# Altium project NXP_FRDM_IMX93.PrjPcb (part 7 of 13)

## Sheet E-15 ENET2.SchDoc: FRDM-IMX93
size 513 x 386 mm; DrawnBy: FORLINX; Organization: ORGANIZATION; Address1: ADDRESS 1; Address2: ADDRESS 2; Address3: ADDRESS 3; Address4: ADDRESS 4; Revision: -; ENG_APP_DATE: --/--/--; DSN_APP_DATE: --/--/--; CHK_APP_DATE: --/--/--; Classification: Public, Company Internal/Proprietary, Company Confidential,  Company Secret; Page Create Date: March  8, 1995; OrgName: NXP Semiconductor; FIUO: A; OrgAddr1: NO. 192 Liangjing Rd. Pudong New Area, ShangHai; Page Number: 15; PageTitle: ENET2; Page Size: C; Page Count: 23; Designer: FORLINX; RevCode: B1; Approver: NXP SE; Doc: SCH-94611 PDF: SPF-94611; DsnPath: T:\FILES\Designs\Single Board Computers\i.MX93-FRDM\Design Files\SCH-94611_B1.DSN; SchematicName: FRDM-i.MX 93 Development Board; PageName: E-15 ENET2; PageSize: C; TopSchematic: True
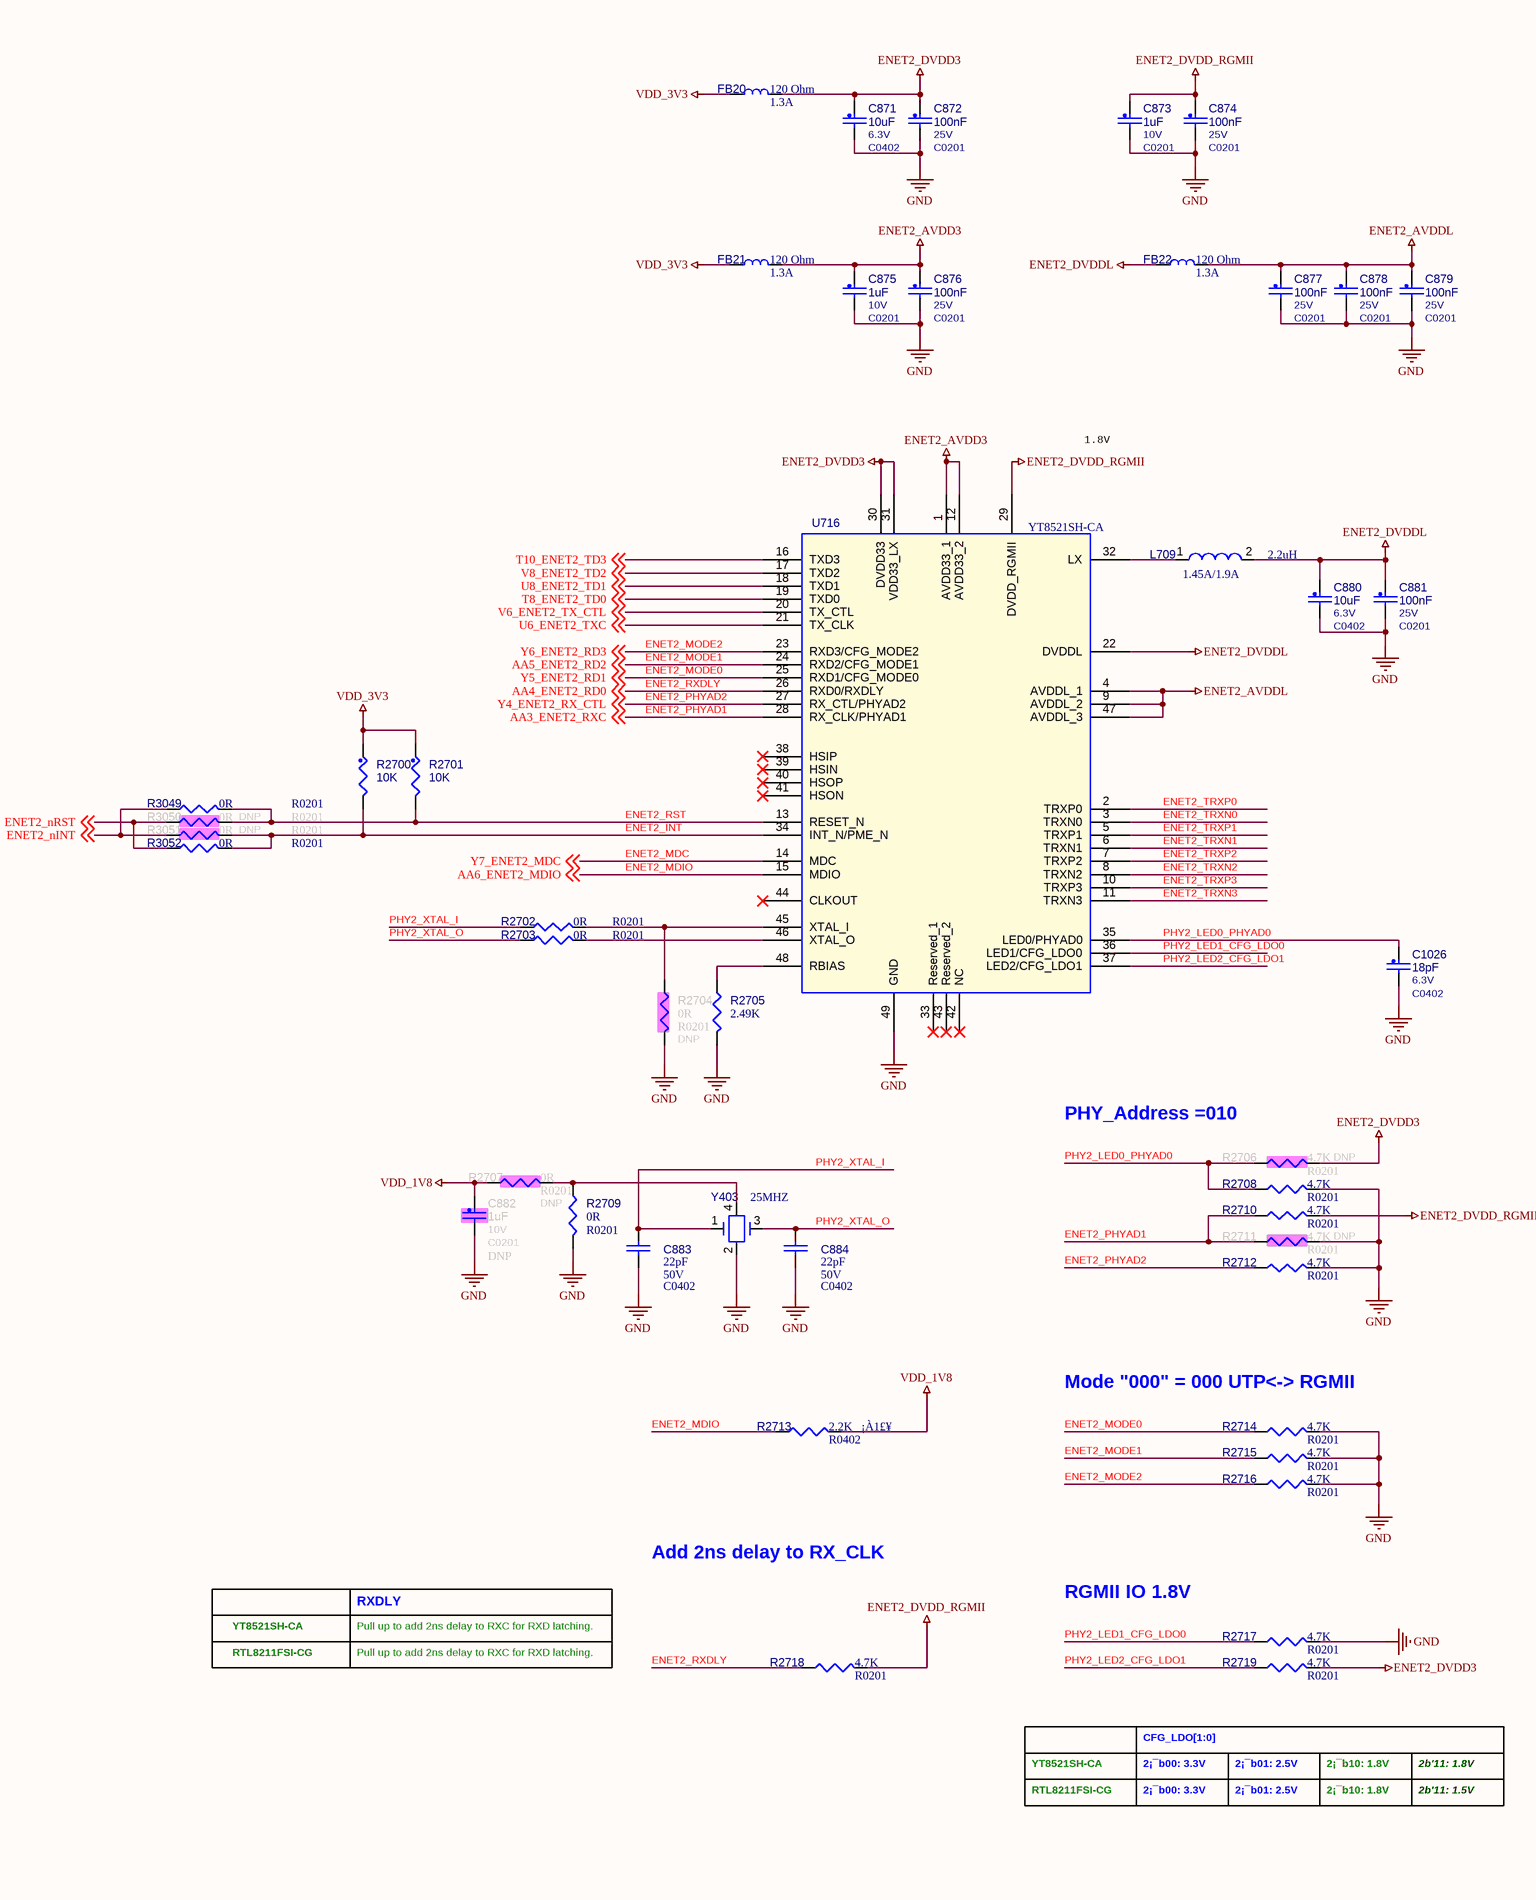
[diagram p27: E-15 ENET2.SchDoc, left]
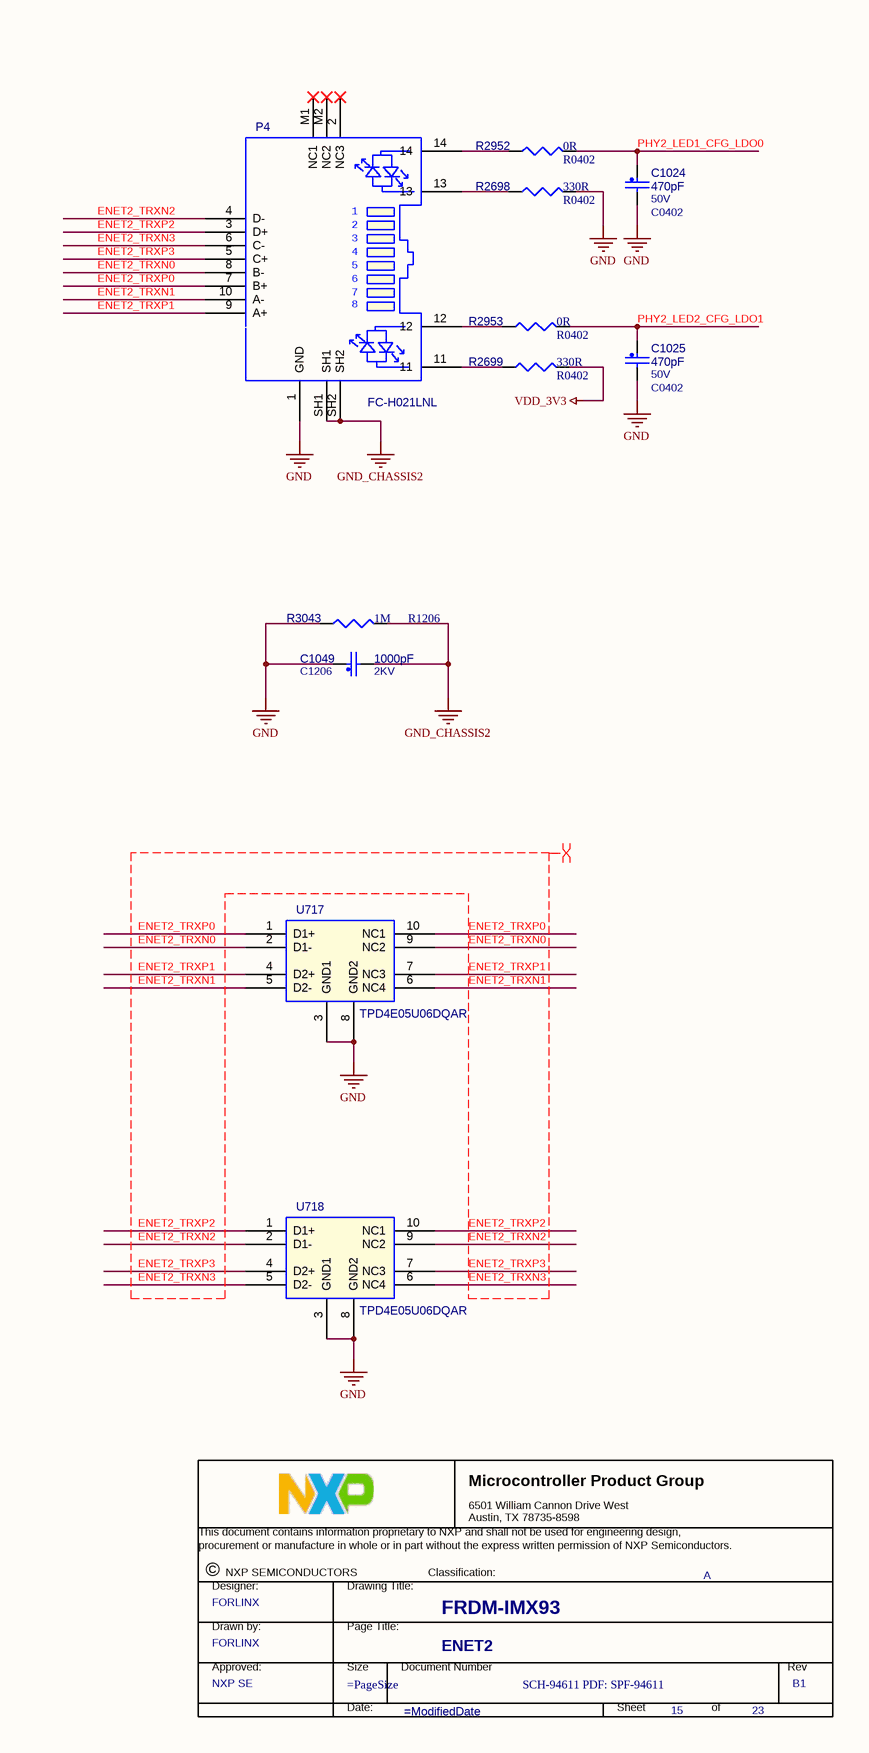
[diagram p28: E-15 ENET2.SchDoc, right]

### Parts
(Parts that share a designator on the sheet are numbered #1, #2 ... from top to bottom, then left to right.)
*#15  Title: FRDM-IMX93  RevCode: B1  PageTitle: ENET2  Page Number: 15  Page Count: 23  DrawnBy: FORLINX  Doc: SCH-94611 PDF: SPF-94611  Approver: NXP SE  FIUO: A  (graphical)
C871  10uF  VOLTAGE: 6.3V  [C0402]
C872  100nF  VOLTAGE: 25V  [C0201]
C873  1uF  VOLTAGE: 10V  [C0201]
C874  100nF  VOLTAGE: 25V  [C0201]
C875  1uF  VOLTAGE: 10V  [C0201]
C876  100nF  VOLTAGE: 25V  [C0201]
C877  100nF  VOLTAGE: 25V  [C0201]
C878  100nF  VOLTAGE: 25V  [C0201]
C879  100nF  VOLTAGE: 25V  [C0201]
C880  10uF  VOLTAGE: 6.3V  [C0402]
C881  100nF  VOLTAGE: 25V  [C0201]
C882  1uF  ASSY_OPT: DNP  VOLTAGE: 10V  [C0201]
C883  22pF  Voltage: 50V  [C0402]
C884  22pF  Voltage: 50V  [C0402]
C1024  470pF  VOLTAGE: 50V  [C0402]
C1025  470pF  VOLTAGE: 50V  [C0402]
C1026  18pF  VOLTAGE: 6.3V  [C0402]
C1049  1000pF  VOLTAGE: 2KV  [C1206]
FB20  120 Ohm  electric current: 1.3A  [FB0402]
FB21  120 Ohm  electric current: 1.3A  [FB0402]
FB22  120 Ohm  electric current: 1.3A  [FB0402]
L709  2.2uH  electric current: 1.45A/1.9A  [IND_2016A]
P4  FC-H021LNL  [RJ45-Gigabit]
R2698  330R  [R0402]
R2699  330R  [R0402]
R2700  10K  [R0201]
R2701  10K  [R0201]
R2702  0R  [R0201]
R2703  0R  [R0201]
R2704  0R  ASSY_OPT: DNP  [R0201]
R2705  2.49K  [R0402]
R2706  4.7K  ASSY_OPT: DNP  [R0201]
R2707  0R  ASSY_OPT: DNP  [R0201]
R2708  4.7K  [R0201]
R2709  0R  [R0201]
R2710  4.7K  [R0201]
R2711  4.7K  ASSY_OPT: DNP  [R0201]
R2712  4.7K  [R0201]
R2713  2.2K  precision: ¡À1£¥  [R0402]
R2714  4.7K  [R0201]
R2715  4.7K  [R0201]
R2716  4.7K  [R0201]
R2717  4.7K  [R0201]
R2718  4.7K  [R0201]
R2719  4.7K  [R0201]
R2952  0R  [R0402]
R2953  0R  [R0402]
R3043  1M  [R1206]
R3049  0R  [R0201]
R3050  0R  ASSY_OPT: DNP  [R0201]
R3051  0R  ASSY_OPT: DNP  [R0201]
R3052  0R  [R0201]
U716  YT8521SH-CA  [QFN48P_0_4BSC_6x6_H]
U717  TPD4E05U06DQAR  [USON-10]
U718  TPD4E05U06DQAR  [USON-10]
Y403  25MHZ  [xtlosc4_3p2x2p5mm_sm]

### Nets
ENET2_AVDD3: C875.1 C876.1 FB21.2 U716.1(AVDD33_1) U716.12(AVDD33_2)
ENET2_AVDDL: C877.1 C878.1 C879.1 FB22.2 U716.4(AVDDL_1) U716.9(AVDDL_2) U716.47(AVDDL_3)
ENET2_DVDD3: C871.1 C872.1 FB20.2 R2706.2 R2719.2 U716.30(DVDD33) U716.31(VDD33_LX)
ENET2_DVDD_RGMII: C873.1 C874.1 R2710.2 R2718.2 U716.29(DVDD_RGMII)
ENET2_DVDDL: C880.1 C881.1 FB22.1 L709.2 U716.22(DVDDL)
GND: C871.2 C872.2 C873.2 C874.2 C875.2 C876.2 C877.2 C878.2 C879.2 C880.2 C881.2 C882.2 C883.2 C884.2 C1024.2 C1025.2 C1026.2 C1049.1 P4.1(GND) R2698.2 R2704.2 R2705.2 R2708.2 R2709.2 R2711.2 R2712.2 R2714.2 R2715.2 R2716.2 R2717.2 R3043.1 U716.49(GND) U717.3(GND1) U717.8(GND2) U718.3(GND1) U718.8(GND2) Y403.2
GND_CHASSIS2: C1049.2 P4.SH1 P4.SH2 R3043.2
VDD_1V8: C882.1 R2707.1 R2713.2  [project net LPD4/x_VDD1]
VDD_3V3: FB20.1 FB21.1 R2699.2 R2700.1 R2701.1
AA4_ENET2_RD0: R2718.1 U716.26(RXD0/RXDLY) ; off-sheet AA4_ENET2_RD0  [also labelled ENET2_RXDLY]  [project net ENET2_RD0]
ENET2_INT: R2700.2 R3051.2 R3052.2 U716.34(INT_N/PME_N)
ENET2_MDC: U716.14(MDC) ; off-sheet Y7_ENET2_MDC  [also labelled Y7_ENET2_MDC]
ENET2_MDIO: R2713.1 U716.15(MDIO) ; off-sheet AA6_ENET2_MDIO  [also labelled AA6_ENET2_MDIO]
ENET2_MODE0: R2714.1 U716.25(RXD1/CFG_MODE0) ; off-sheet Y5_ENET2_RD1  [also labelled Y5_ENET2_RD1]
ENET2_MODE1: R2715.1 U716.24(RXD2/CFG_MODE1) ; off-sheet AA5_ENET2_RD2  [also labelled AA5_ENET2_RD2]
ENET2_MODE2: R2716.1 U716.23(RXD3/CFG_MODE2) ; off-sheet Y6_ENET2_RD3  [also labelled Y6_ENET2_RD3]
ENET2_nINT: R3049.1 R3051.1 ; off-sheet ENET2_nINT
ENET2_nRST: R3050.1 R3052.1 ; off-sheet ENET2_nRST
ENET2_PHYAD1: R2710.1 R2711.1 U716.28(RX_CLK/PHYAD1) ; off-sheet AA3_ENET2_RXC  [also labelled AA3_ENET2_RXC]
ENET2_PHYAD2: R2712.1 U716.27(RX_CTL/PHYAD2) ; off-sheet Y4_ENET2_RX_CTL  [also labelled Y4_ENET2_RX_CTL]
ENET2_RST: R2701.2 R3049.2 R3050.2 U716.13(RESET_N)
ENET2_TRXN0: P4.8(B-) U716.3(TRXN0) U717.2(D1-) U717.9(NC2)
ENET2_TRXN1: P4.10(A-) U716.6(TRXN1) U717.5(D2-) U717.6(NC4)
ENET2_TRXN2: P4.4(D-) U716.8(TRXN2) U718.2(D1-) U718.9(NC2)
ENET2_TRXN3: P4.6(C-) U716.11(TRXN3) U718.5(D2-) U718.6(NC4)
ENET2_TRXP0: P4.7(B+) U716.2(TRXP0) U717.1(D1+) U717.10(NC1)
ENET2_TRXP1: P4.9(A+) U716.5(TRXP1) U717.4(D2+) U717.7(NC3)
ENET2_TRXP2: P4.3(D+) U716.7(TRXP2) U718.1(D1+) U718.10(NC1)
ENET2_TRXP3: P4.5(C+) U716.10(TRXP3) U718.4(D2+) U718.7(NC3)
PHY2_LED0_PHYAD0: C1026.1 R2706.1 R2708.1 U716.35(LED0/PHYAD0)
PHY2_LED1_CFG_LDO0: C1024.1 R2717.1 R2952.2 U716.36(LED1/CFG_LDO0)
PHY2_LED2_CFG_LDO1: C1025.1 R2719.1 R2953.2 U716.37(LED2/CFG_LDO1)
PHY2_XTAL_I: C883.1 R2702.1 Y403.1
PHY2_XTAL_O: C884.1 R2703.1 Y403.3
T8_ENET2_TD0: U716.19(TXD0) ; off-sheet T8_ENET2_TD0  [project net ENET2_TD0]
T10_ENET2_TD3: U716.16(TXD3) ; off-sheet T10_ENET2_TD3  [project net ENET2_TD3]
U6_ENET2_TXC: U716.21(TX_CLK) ; off-sheet U6_ENET2_TXC  [project net ENET2_TXC]
U8_ENET2_TD1: U716.18(TXD1) ; off-sheet U8_ENET2_TD1  [project net ENET2_TD1]
V6_ENET2_TX_CTL: U716.20(TX_CTL) ; off-sheet V6_ENET2_TX_CTL  [project net ENET2_TX_CTL]
V8_ENET2_TD2: U716.17(TXD2) ; off-sheet V8_ENET2_TD2  [project net ENET2_TD2]
NetL709_1: L709.1 U716.32(LX)
NetP4_11: P4.11 R2699.1
NetP4_12: P4.12 R2953.1
NetP4_13: P4.13 R2698.1
NetP4_14: P4.14 R2952.1
NetR2702_2: R2702.2 R2704.1 U716.45(XTAL_I)
NetR2703_2: R2703.2 U716.46(XTAL_O)
NetR2705_1: R2705.1 U716.48(RBIAS)
NetR2707_2: R2707.2 R2709.1 Y403.4

Not connected (* = marked no-connect by the designer): P4 2(NC3)* M1(NC1)* M2(NC2)*; U716 33(Reserved_1)* 38(HSIP)* 39(HSIN)* 40(HSOP)* 41(HSON)* 42(NC)* 43(Reserved_2)* 44(CLKOUT)*

### Layout directives
differential pair: ENET2_TRXN0, ENET2_TRXN1, ENET2_TRXN2, ENET2_TRXN3, ENET2_TRXP0, ENET2_TRXP1, ENET2_TRXP2, ENET2_TRXP3

### Notes on the sheet
- 1.8V
- PHY_Address =010
- (near R2714) Mode "000" = 000 UTP<-> RGMII
- Add 2ns delay to RX_CLK
- YT8521SH-CA
- Pull up to add 2ns delay to RXC for RXD latching.
- RXDLY
- RGMII IO 1.8V
- RTL8211FSI-CG
- 2¡¯b00: 3.3V
- CFG_LDO[1:0]
- 2¡¯b01: 2.5V
- 2¡¯b10: 1.8V
- 2b'11: 1.8V
- 2b'11: 1.5V
- DWG. NO.
- REV.
- SHT.
- REVISION
- DESCRIPTION
- DATE
- APPROVED
- ENG:
- APPROVALS
- quilter.ai <http://quilter.ai>
- DSN:
- CHK:
- REFERENCE DOCUMENTS
- TITLE
- PROJECT
- BOM:
- FAB DWG:
- PCB DWG:
- ASSY DWG:
- SIZE
- FILE NAME
- C
- DWG NO.
- SHEET
- OF
- REV
- (in symbol TitleBlock_MCPG) Microcontroller Product Group; 6501 William Cannon Drive West / Austin, TX 78735-8598; This document contains information proprietary to NXP and shall not be used for engineering design,; procurement or manufacture in whole or in part without the express written permission of NXP Semiconductors.; ©; NXP SEMICONDUCTORS; Classification:; Designer:; Drawing Title:; Drawn by:; Page Title:; Approved:; Size; Document Number; Rev; Date:; Sheet; of

### Library data of the parts
*#15 = TitleBlock_MCPG: Classification: Public, Company Internal/Proprietary, Company Confidential,  Company Secret; OrgName: NXP Semiconductor; OrgAddr1: NO. 192 Liangjing Rd. Pudong New Area, ShangHai; Page Size: =PageSize; Page Create Date: March  8, 1995; Designer: FORLINX; Page Modify Date: =ModifiedDate
C871 = CAP_NP: 0402,10uF,6.3V,+/-20%,X5R; Part Reference: C871; CLASS: DISCRETE; Tolerance: 20%; MFG_NAME01: FENGHUA; MFG_PN01: 0402X106M6R3NT; CAD_APPROVED: Yes; FPLIST: CC0402_25,CC0402_HD,0402_CC; Value: 10uF; ROHS: Yes; HEIGHT: 0.65 MM; PCB Footprint: C0402
C872 = CAP_NP: 0201,100nF,25V,+/-10%,X5R; Part Reference: C872; CLASS: DISCRETE; FPLIST: CC0402_25,CC0402_HD,0402_CC; CAD_APPROVED: Yes; MFG_PN01: 0201X104K250NT; MFG_NAME01: FENGHUA; Tolerance: 20%; Value: 100nF; HEIGHT: 0.65 MM; ROHS: Yes; PCB Footprint: C0201
C873 = CAP_NP: 0201,1uF,10V,+/-20%,X5R; Part Reference: C873; CLASS: DISCRETE; FPLIST: CC0201,CC0201_HD,0201_CC,0201_CC_012SM_NSP; CAD_APPROVED: Yes; MFG_PN01: CL03A105MP3NSNC; MFG_NAME01: SAMSUNG; Tolerance: 20%; Value: 1uF; Package Type: 7¡± reel; Package Size: 0201; HEIGHT: 0.35MM; ROHS: Yes; PCB Footprint: C0201
C874 = CAP_NP: 0201,100nF,25V,+/-10%,X5R; Part Reference: C874; CLASS: DISCRETE; Tolerance: 20%; MFG_NAME01: FENGHUA; MFG_PN01: 0201X104K250NT; CAD_APPROVED: Yes; FPLIST: CC0402_25,CC0402_HD,0402_CC; Value: 100nF; ROHS: Yes; HEIGHT: 0.65 MM; PCB Footprint: C0201
C875 = CAP_NP: 0201,1uF,10V,+/-20%,X5R; Part Reference: C875; CLASS: DISCRETE; Tolerance: 20%; MFG_NAME01: SAMSUNG; MFG_PN01: CL03A105MP3NSNC; CAD_APPROVED: Yes; FPLIST: CC0201,CC0201_HD,0201_CC,0201_CC_012SM_NSP; Value: 1uF; ROHS: Yes; HEIGHT: 0.35MM; Package Size: 0201; Package Type: 7¡± reel; PCB Footprint: C0201
C876 = CAP_NP: 0201,100nF,25V,+/-10%,X5R; Part Reference: C876; CLASS: DISCRETE; FPLIST: CC0402_25,CC0402_HD,0402_CC; CAD_APPROVED: Yes; MFG_PN01: 0201X104K250NT; MFG_NAME01: FENGHUA; Tolerance: 20%; Value: 100nF; HEIGHT: 0.65 MM; ROHS: Yes; PCB Footprint: C0201
C877 = CAP_NP: 0201,100nF,25V,+/-10%,X5R; Part Reference: C877; CLASS: DISCRETE; FPLIST: CC0402_25,CC0402_HD,0402_CC; CAD_APPROVED: Yes; MFG_PN01: 0201X104K250NT; MFG_NAME01: FENGHUA; Tolerance: 20%; Value: 100nF; HEIGHT: 0.65 MM; ROHS: Yes; PCB Footprint: C0201
C878 = CAP_NP: 0201,100nF,25V,+/-10%,X5R; Part Reference: C878; CLASS: DISCRETE; FPLIST: CC0402_25,CC0402_HD,0402_CC; CAD_APPROVED: Yes; MFG_PN01: 0201X104K250NT; MFG_NAME01: FENGHUA; Tolerance: 20%; Value: 100nF; HEIGHT: 0.65 MM; ROHS: Yes; PCB Footprint: C0201
C879 = CAP_NP: 0201,100nF,25V,+/-10%,X5R; Part Reference: C879; CLASS: DISCRETE; Tolerance: 20%; MFG_NAME01: FENGHUA; MFG_PN01: 0201X104K250NT; CAD_APPROVED: Yes; FPLIST: CC0402_25,CC0402_HD,0402_CC; Value: 100nF; ROHS: Yes; HEIGHT: 0.65 MM; PCB Footprint: C0201
C880 = CAP_NP: 0402,10uF,6.3V,+/-20%,X5R; Part Reference: C880; CLASS: DISCRETE; Tolerance: 20%; MFG_NAME01: FENGHUA; MFG_PN01: 0402X106M6R3NT; CAD_APPROVED: Yes; FPLIST: CC0402_25,CC0402_HD,0402_CC; Value: 10uF; ROHS: Yes; HEIGHT: 0.65 MM; PCB Footprint: C0402
C881 = CAP_NP: 0201,100nF,25V,+/-10%,X5R; Part Reference: C881; CLASS: DISCRETE; Tolerance: 20%; MFG_NAME01: FENGHUA; MFG_PN01: 0201X104K250NT; CAD_APPROVED: Yes; FPLIST: CC0402_25,CC0402_HD,0402_CC; Value: 100nF; ROHS: Yes; HEIGHT: 0.65 MM; PCB Footprint: C0201
C882 = CAP_NP: 0201,1uF,10V,+/-20%,X5R; Part Reference: C882; CLASS: DISCRETE; Tolerance: 20%; MFG_NAME01: SAMSUNG; MFG_PN01: CL03A105MP3NSNC; CAD_APPROVED: Yes; FPLIST: CC0201,CC0201_HD,0201_CC,0201_CC_012SM_NSP; Value: 1uF; ROHS: Yes; HEIGHT: 0.35MM; Package Size: 0201; Package Type: 7¡± reel; PCB Footprint: C0201
C883 = C0402,22pF: 0402,22pF,50V,+/-5%,NPO; Part Reference: C883; serial number: 1110202003; MFG_NAME01: FENGHUA; MFG_PN01: 0402CG220J500NT; PCB Footprint: C0402; Value: 22pF
C884 = C0402,22pF: 0402,22pF,50V,+/-5%,NPO; Part Reference: C884; serial number: 1110202003; MFG_NAME01: FENGHUA; MFG_PN01: 0402CG220J500NT; PCB Footprint: C0402; Value: 22pF
C1024 = CAP_NP: 0402,470pF,50V,+/-5%,NPO; Part Reference: C1024; CLASS: DISCRETE; Tolerance: 20%; MFG_NAME01: FENGHUA; MFG_PN01: 0402CG471J500NT; CAD_APPROVED: Yes; FPLIST: CC0402_25,CC0402_HD,0402_CC; Value: 470pF; ROHS: Yes; HEIGHT: 0.65 MM; PCB Footprint: C0402
C1025 = CAP_NP: 0402,470pF,50V,+/-5%,NPO; Part Reference: C1025; CLASS: DISCRETE; FPLIST: CC0402_25,CC0402_HD,0402_CC; CAD_APPROVED: Yes; MFG_PN01: 0402CG471J500NT; MFG_NAME01: FENGHUA; Tolerance: 20%; Value: 470pF; HEIGHT: 0.65 MM; ROHS: Yes; PCB Footprint: C0402
C1026 = CAP_NP: 0402,18pF,50V,+/-5%,NPO; Part Reference: C1026; CLASS: DISCRETE; Tolerance: 20%; MFG_NAME01: FENGHUA; MFG_PN01: 0402B103K500NT; CAD_APPROVED: Yes; FPLIST: CC0402_25,CC0402_HD,0402_CC; Value: 18pF; ROHS: Yes; HEIGHT: 0.65 MM; PCB Footprint: C0402
C1049 = CAP_NP: 1206,1nF,2KV,+/-10%; Part Reference: C1049; CLASS: DISCRETE; Tolerance: 20%; MFG_NAME01: FENGHUA; MFG_PN01: 1206B102K202NT; CAD_APPROVED: Yes; FPLIST: CC0402_25,CC0402_HD,0402_CC; Value: 1000pF; ROHS: Yes; HEIGHT: 0.65 MM; PCB Footprint: C1206
FB20 = FB0402,120ohm,1.3A: 0402,120Ohm@100MHz,2A; Part Reference: FB20; serial number: 1110304038; MFG_NAME01: Murata; MFG_PN01: BLM15PX121SN1D; PCB Footprint: FB0402; Value: 120 Ohm
FB21 = FB0402,120ohm,1.3A: 0402,120Ohm@100MHz,2A; Part Reference: FB21; serial number: 1110304038; MFG_NAME01: Murata; MFG_PN01: BLM15PX121SN1D; PCB Footprint: FB0402; Value: 120 Ohm
FB22 = FB0402,120ohm,1.3A: 0402,120Ohm@100MHz,2A; Part Reference: FB22; serial number: 1110304038; MFG_NAME01: Murata; MFG_PN01: BLM15PX121SN1D; PCB Footprint: FB0402; Value: 120 Ohm
L709 = INDUCTOR-WPN201612HR47MT: 2.2uH,2*1.6*1mm,2.15A; Part Reference: L709; serial number: 1110301115; MFG_NAME01: Sunlord; MFG_PN01: WPN201610H2R2MT; Value: 2.2uH; PCB Footprint: IND_2016A
P4 = FC-H021LNL_0: HR851178A,RJ45,1000M; Part Reference: P4; MFG_NAME01: Hanrun; Value: FC-H021LNL; MFG_PN01: HR851178A; PCB Footprint: RJ45-Gigabit
R2698 = R0402,4.7K_Dup1: 0402,330Ohm,+/-1%; Part Reference: R2698; precision: ¡À1£¥; serial number: 1110102015; MFG_NAME01: FENGHUA; MFG_PN01: RC-02W3300FT; PCB Footprint: R0402; Value: 330R
R2699 = R0402,4.7K_Dup1: 0402,330Ohm,+/-1%; Part Reference: R2699; precision: ¡À1£¥; serial number: 1110102015; MFG_NAME01: FENGHUA; MFG_PN01: RC-02W3300FT; PCB Footprint: R0402; Value: 330R
R2700 = RES: 0201,10K,+/-5%; Part Reference: R2700; CLASS: DISCRETE; TOL: 5%; MFG_NAME01: FENGHUA; MFG_PN01: RC-01W103JT; CAD_APPROVED: Yes; FPLIST: RC0402_25,RC0402_HD,RC0402_X2,0402_CC,CAPC0402_L; Value: 10K; HEIGHT: 0.41mm; Tolerance: 5%; ROHS: Yes; PCB Footprint: R0201
R2701 = RES: 0201,10K,+/-5%; Part Reference: R2701; CLASS: DISCRETE; TOL: 5%; MFG_NAME01: FENGHUA; MFG_PN01: RC-01W103JT; CAD_APPROVED: Yes; FPLIST: RC0402_25,RC0402_HD,RC0402_X2,0402_CC,CAPC0402_L; Value: 10K; HEIGHT: 0.41mm; Tolerance: 5%; ROHS: Yes; PCB Footprint: R0201
R2702 = R0402,1.5K: 0201,0Ohm,+/-5%; Part Reference: R2702; serial number: 1110102060; precision: ¡À1£¥; MFG_NAME01: FENGHUA; MFG_PN01: RC-01000JT; PCB Footprint: R0201; Value: 0R
R2703 = R0402,1.5K: 0201,0Ohm,+/-5%; Part Reference: R2703; serial number: 1110102060; precision: ¡À1£¥; MFG_NAME01: FENGHUA; MFG_PN01: RC-01000JT; PCB Footprint: R0201; Value: 0R
R2704 = R0402,1.5K: 0201,0Ohm,+/-5%; Part Reference: R2704; serial number: 1110102060; precision: ¡À1£¥; MFG_PN01: RC-01000JT; MFG_NAME01: FENGHUA; PCB Footprint: R0201; Value: 0R
R2705 = R0402,2.49K: 0402,2.49K,+/-1%; Part Reference: R2705; precision: ¡À1£¥; serial number: 1110102182; MFG_NAME01: FENGHUA; MFG_PN01: RC-02W2491FT; PCB Footprint: R0402; Value: 2.49K
R2706 = R0402,4.7K_Dup1: 0201,4.7K,+/-1%; Part Reference: R2706; precision: ¡À1£¥; serial number: 1110102015; MFG_NAME01: FENGHUA; MFG_PN01: RC-01W4701FT; PCB Footprint: R0201; Value: 4.7K
R2707 = R0402,1.5K: 0201,0Ohm,+/-5%; Part Reference: R2707; serial number: 1110102060; precision: ¡À1£¥; MFG_NAME01: FENGHUA; MFG_PN01: RC-01000JT; PCB Footprint: R0201; Value: 0R
R2708 = R0402,4.7K_Dup1: 0201,4.7K,+/-1%; Part Reference: R2708; precision: ¡À1£¥; serial number: 1110102015; MFG_NAME01: FENGHUA; MFG_PN01: RC-01W4701FT; PCB Footprint: R0201; Value: 4.7K
R2709 = R0402,1.5K: 0201,0Ohm,+/-5%; Part Reference: R2709; serial number: 1110102060; precision: ¡À1£¥; MFG_NAME01: FENGHUA; MFG_PN01: RC-01000JT; PCB Footprint: R0201; Value: 0R
R2710 = R0402,4.7K_Dup1: 0201,4.7K,+/-1%; Part Reference: R2710; precision: ¡À1£¥; serial number: 1110102015; MFG_NAME01: FENGHUA; MFG_PN01: RC-01W4701FT; PCB Footprint: R0201; Value: 4.7K
R2711 = R0402,4.7K_Dup1: 0201,4.7K,+/-1%; Part Reference: R2711; precision: ¡À1£¥; serial number: 1110102015; MFG_NAME01: FENGHUA; MFG_PN01: RC-01W4701FT; PCB Footprint: R0201; Value: 4.7K
R2712 = R0402,4.7K_Dup1: 0201,4.7K,+/-1%; Part Reference: R2712; precision: ¡À1£¥; serial number: 1110102015; MFG_NAME01: FENGHUA; MFG_PN01: RC-01W4701FT; PCB Footprint: R0201; Value: 4.7K
R2713 = R0402,1.5K: 0402,2.2K,+/-1%; Part Reference: R2713; serial number: 1110102060; MFG_NAME01: FENGHUA; MFG_PN01: RC-02K2201FT; PCB Footprint: R0402; Value: 2.2K
R2714 = R0402,4.7K_Dup1: 0201,4.7K,+/-1%; Part Reference: R2714; precision: ¡À1£¥; serial number: 1110102015; MFG_NAME01: FENGHUA; MFG_PN01: RC-01W4701FT; PCB Footprint: R0201; Value: 4.7K
R2715 = R0402,4.7K_Dup1: 0201,4.7K,+/-1%; Part Reference: R2715; precision: ¡À1£¥; serial number: 1110102015; MFG_NAME01: FENGHUA; MFG_PN01: RC-01W4701FT; PCB Footprint: R0201; Value: 4.7K
R2716 = R0402,4.7K_Dup1: 0201,4.7K,+/-1%; Part Reference: R2716; precision: ¡À1£¥; serial number: 1110102015; MFG_NAME01: FENGHUA; MFG_PN01: RC-01W4701FT; PCB Footprint: R0201; Value: 4.7K
R2717 = R0402,4.7K_Dup1: 0201,4.7K,+/-1%; Part Reference: R2717; precision: ¡À1£¥; serial number: 1110102015; MFG_NAME01: FENGHUA; MFG_PN01: RC-01W4701FT; PCB Footprint: R0201; Value: 4.7K
R2718 = R0402,4.7K_Dup1: 0201,4.7K,+/-1%; Part Reference: R2718; precision: ¡À1£¥; serial number: 1110102015; MFG_NAME01: FENGHUA; MFG_PN01: RC-01W4701FT; PCB Footprint: R0201; Value: 4.7K
R2719 = R0402,4.7K_Dup1: 0201,4.7K,+/-1%; Part Reference: R2719; precision: ¡À1£¥; serial number: 1110102015; MFG_NAME01: FENGHUA; MFG_PN01: RC-01W4701FT; PCB Footprint: R0201; Value: 4.7K
R2952 = R0402,4.7K_Dup1: 0402,0Ohm,+/-1%; Part Reference: R2952; precision: ¡À1£¥; serial number: 1110102015; MFG_NAME01: FENGHUA; MFG_PN01: RC-02000FT; PCB Footprint: R0402; Value: 0R
R2953 = R0402,4.7K_Dup1: 0402,0Ohm,+/-1%; Part Reference: R2953; precision: ¡À1£¥; serial number: 1110102015; MFG_NAME01: FENGHUA; MFG_PN01: RC-02000FT; PCB Footprint: R0402; Value: 0R
R3043 = R0402,4.7K_Dup1: 1206,1M,+/-5%; Part Reference: R3043; precision: ¡À1£¥; serial number: 1110102015; MFG_NAME01: FENGHUA; MFG_PN01: RS-06K105JT; PCB Footprint: R1206; Value: 1M
R3049 = R0402,1.5K: 0201,0Ohm,+/-5%; Part Reference: R3049; serial number: 1110102060; precision: ¡À1£¥; MFG_NAME01: FENGHUA; MFG_PN01: RC-01000JT; PCB Footprint: R0201; Value: 0R
R3050 = R0402,1.5K: 0201,0Ohm,+/-5%; Part Reference: R3050; serial number: 1110102060; precision: ¡À1£¥; MFG_NAME01: FENGHUA; MFG_PN01: RC-01000JT; PCB Footprint: R0201; Value: 0R
R3051 = R0402,1.5K: 0201,0Ohm,+/-5%; Part Reference: R3051; serial number: 1110102060; precision: ¡À1£¥; MFG_PN01: RC-01000JT; MFG_NAME01: FENGHUA; PCB Footprint: R0201; Value: 0R
R3052 = R0402,1.5K: 0201,0Ohm,+/-5%; Part Reference: R3052; serial number: 1110102060; precision: ¡À1£¥; MFG_NAME01: FENGHUA; MFG_PN01: RC-01000JT; PCB Footprint: R0201; Value: 0R
U716 = YT8521SH-CA: Part Reference: U716; MFG_NAME01: MotorComm; Value: YT8521SH-CA; MFG_PN01: YT8521SH-CA; PCB Footprint: QFN48P_0_4BSC_6x6_H
U717 = TPD4E05U06DQAR_8: TPD4E05U06DQAR,USON; Part Reference: U717; MFG_NAME01: TI; Value: TPD4E05U06DQAR; MFG_PN01: TPD4E05U06DQAR; PCB Footprint: USON-10
U718 = TPD4E05U06DQAR_9: TPD4E05U06DQAR,USON; Part Reference: U718; MFG_NAME01: TI; Value: TPD4E05U06DQAR; MFG_PN01: TPD4E05U06DQAR; PCB Footprint: USON-10
Y403 = CRYSTAL_4P-TSX-3225: Crystal,25MHZ,4P,3.2*2.5mm,+/-20ppm,20pf; Part Reference: Y403; serial number: 1110601039; MFG_NAME01: Dongxin Hengke; MFG_PN01: SE25000O33D; Value: 25MHZ; PCB Footprint: xtlosc4_3p2x2p5mm_sm

## Sheet E-16 LVDS to HDMI.SchDoc: FRDM-IMX93
size 513 x 386 mm; DrawnBy: FORLINX; Organization: ORGANIZATION; Address1: ADDRESS 1; Address2: ADDRESS 2; Address3: ADDRESS 3; Address4: ADDRESS 4; Revision: -; ENG_APP_DATE: --/--/--; DSN_APP_DATE: --/--/--; CHK_APP_DATE: --/--/--; Classification: Public, Company Internal/Proprietary, Company Confidential,  Company Secret; Page Create Date: March  8, 1995; OrgName: NXP Semiconductor; FIUO: A; OrgAddr1: NO. 192 Liangjing Rd. Pudong New Area, ShangHai; Page Number: 16; PageTitle: LVDS to HDMI; Page Size: C; Page Count: 23; Designer: FORLINX; RevCode: B1; Approver: NXP SE; Doc: SCH-94611 PDF: SPF-94611; DsnPath: T:\FILES\Designs\Single Board Computers\i.MX93-FRDM\Design Files\SCH-94611_B1.DSN; SchematicName: FRDM-i.MX 93 Development Board; PageName: E-16 LVDS to HDMI; PageSize: C; TopSchematic: True
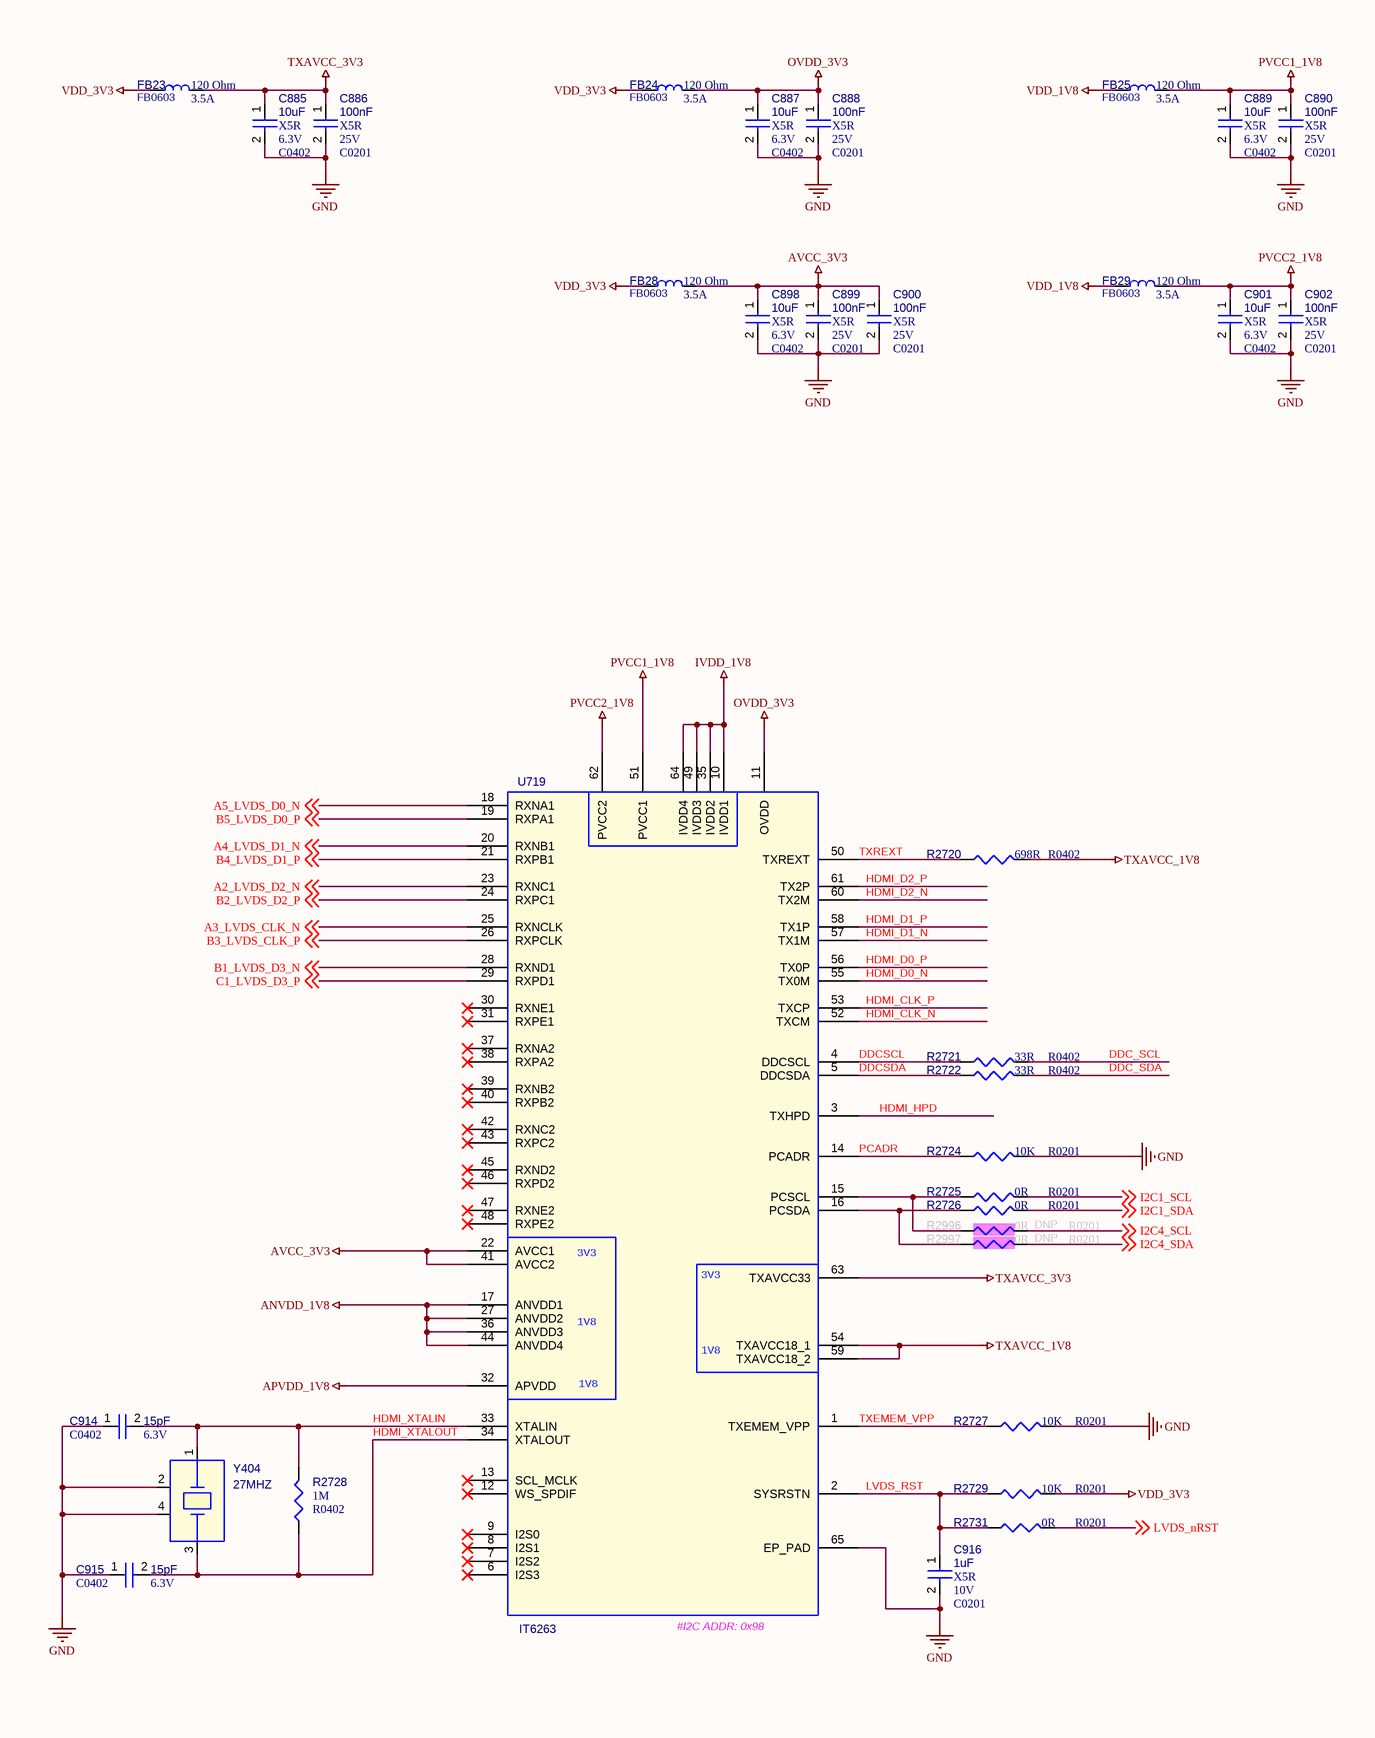
[diagram p29: E-16 LVDS to HDMI.SchDoc, left]
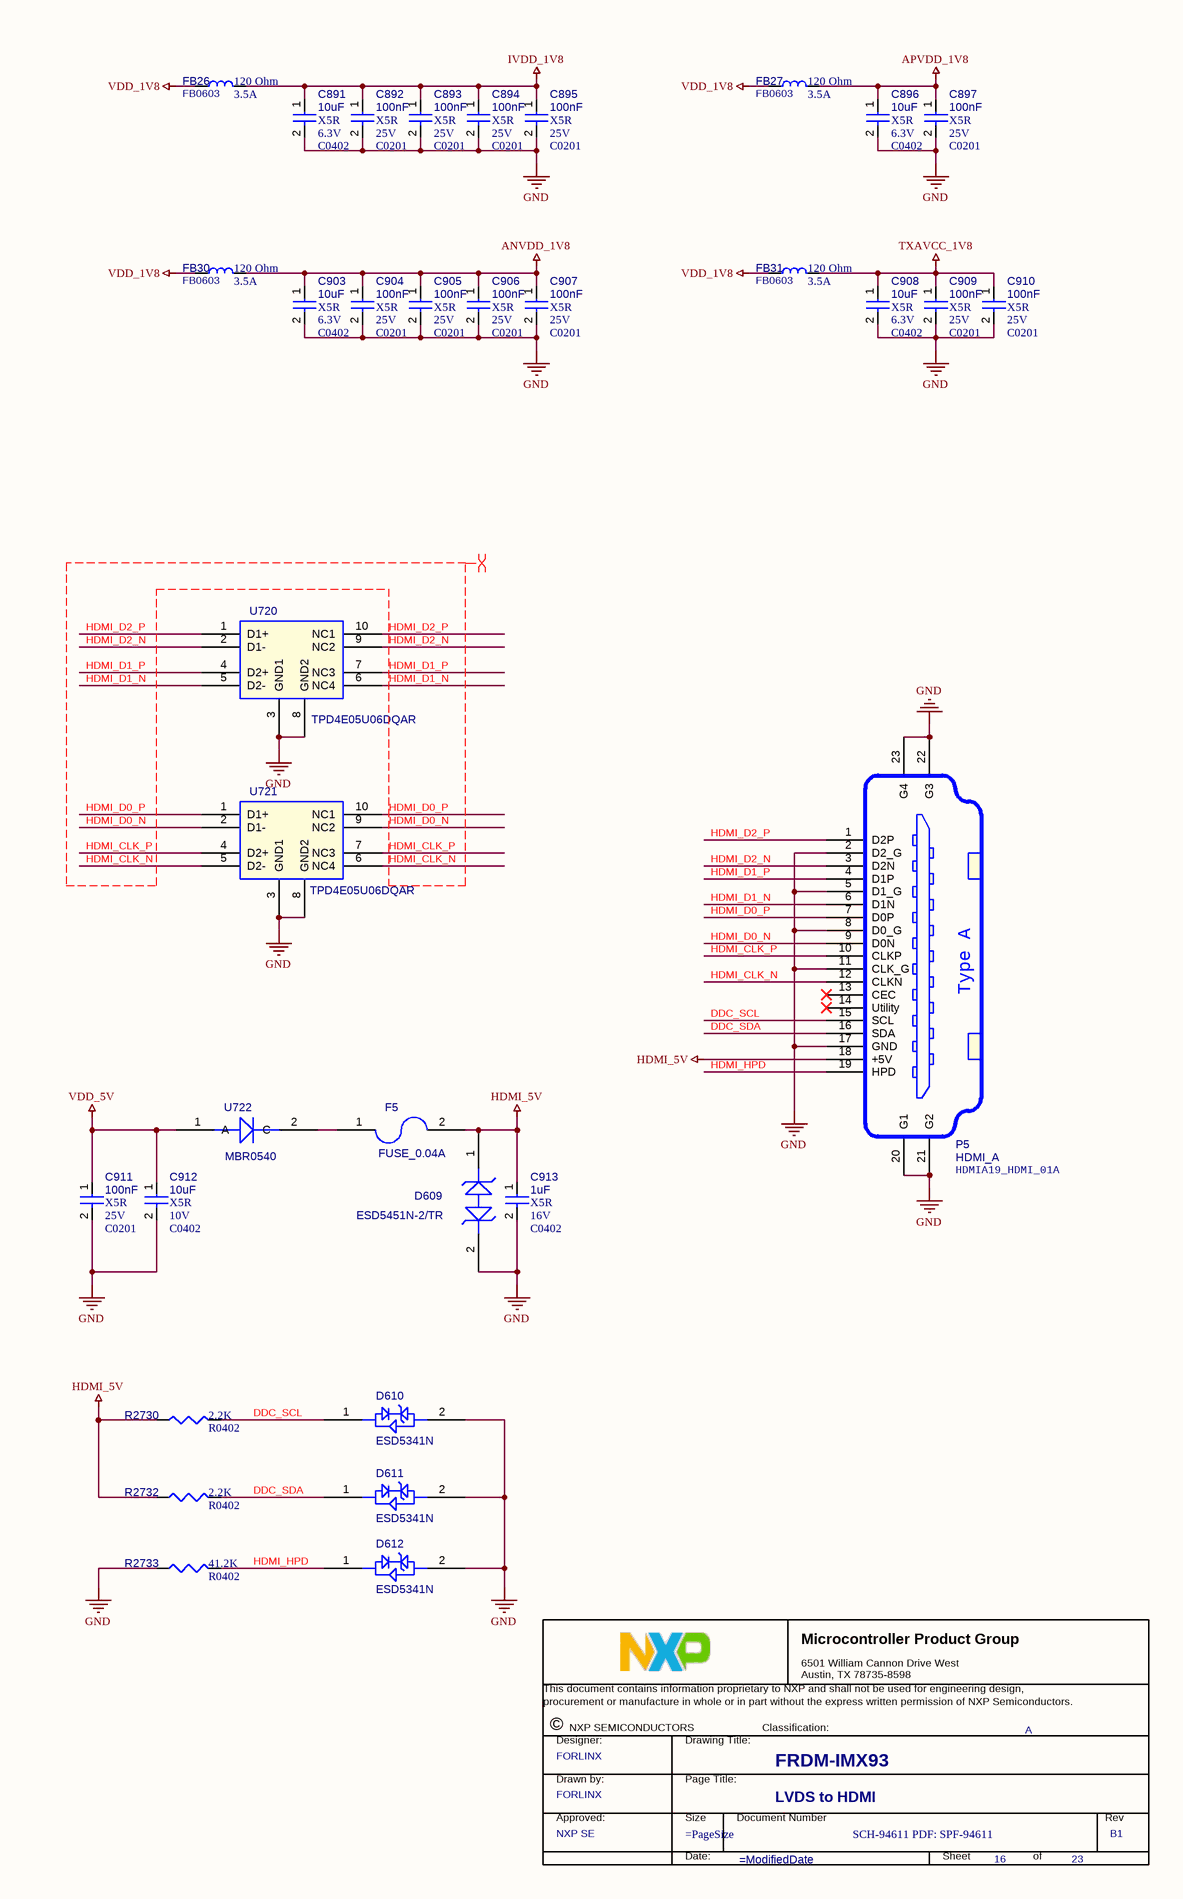
[diagram p30: E-16 LVDS to HDMI.SchDoc, right]

### Parts
(Parts that share a designator on the sheet are numbered #1, #2 ... from top to bottom, then left to right.)
*#16  Title: FRDM-IMX93  RevCode: B1  PageTitle: LVDS to HDMI  Page Number: 16  Page Count: 23  DrawnBy: FORLINX  Doc: SCH-94611 PDF: SPF-94611  Approver: NXP SE  FIUO: A  (graphical)
C885  10uF  Voltage: 6.3V  Dielectric: X5R  [C0402]
C886  100nF  Voltage: 25V  Dielectric: X5R  [C0201]
C887  10uF  Voltage: 6.3V  Dielectric: X5R  [C0402]
C888  100nF  Voltage: 25V  Dielectric: X5R  [C0201]
C889  10uF  Voltage: 6.3V  Dielectric: X5R  [C0402]
C890  100nF  Voltage: 25V  Dielectric: X5R  [C0201]
C891  10uF  Voltage: 6.3V  Dielectric: X5R  [C0402]
C892  100nF  Voltage: 25V  Dielectric: X5R  [C0201]
C893  100nF  Voltage: 25V  Dielectric: X5R  [C0201]
C894  100nF  Voltage: 25V  Dielectric: X5R  [C0201]
C895  100nF  Voltage: 25V  Dielectric: X5R  [C0201]
C896  10uF  Voltage: 6.3V  Dielectric: X5R  [C0402]
C897  100nF  Voltage: 25V  Dielectric: X5R  [C0201]
C898  10uF  Voltage: 6.3V  Dielectric: X5R  [C0402]
C899  100nF  Voltage: 25V  Dielectric: X5R  [C0201]
C900  100nF  Voltage: 25V  Dielectric: X5R  [C0201]
C901  10uF  Voltage: 6.3V  Dielectric: X5R  [C0402]
C902  100nF  Voltage: 25V  Dielectric: X5R  [C0201]
C903  10uF  Voltage: 6.3V  Dielectric: X5R  [C0402]
C904  100nF  Voltage: 25V  Dielectric: X5R  [C0201]
C905  100nF  Voltage: 25V  Dielectric: X5R  [C0201]
C906  100nF  Voltage: 25V  Dielectric: X5R  [C0201]
C907  100nF  Voltage: 25V  Dielectric: X5R  [C0201]
C908  10uF  Voltage: 6.3V  Dielectric: X5R  [C0402]
C909  100nF  Voltage: 25V  Dielectric: X5R  [C0201]
C910  100nF  Voltage: 25V  Dielectric: X5R  [C0201]
C911  100nF  Voltage: 25V  Dielectric: X5R  [C0201]
C912  10uF  Voltage: 10V  Dielectric: X5R  [C0402]
C913  1uF  Voltage: 16V  Dielectric: X5R  [C0402]
C914  15pF  Voltage: 6.3V  [C0402]
C915  15pF  Voltage: 6.3V  [C0402]
C916  1uF  Voltage: 10V  Dielectric: X5R  [C0201]
D609  ESD5451N-2/TR  [0402TVS]
D610  ESD5341N  [0402TVS]
D611  ESD5341N  [0402TVS]
D612  ESD5341N  [0402TVS]
F5  FUSE_0.04A  [F0603]
FB23  120 Ohm  electric current: 3.5A  [FB0603]
FB24  120 Ohm  electric current: 3.5A  [FB0603]
FB25  120 Ohm  electric current: 3.5A  [FB0603]
FB26  120 Ohm  electric current: 3.5A  [FB0603]
FB27  120 Ohm  electric current: 3.5A  [FB0603]
FB28  120 Ohm  electric current: 3.5A  [FB0603]
FB29  120 Ohm  electric current: 3.5A  [FB0603]
FB30  120 Ohm  electric current: 3.5A  [FB0603]
FB31  120 Ohm  electric current: 3.5A  [FB0603]
P5  HDMI_A  [HDMIA19_HDMI_01A]
R2720  698R  [R0402]
R2721  33R  [R0402]
R2722  33R  [R0402]
R2724  10K  [R0201]
R2725  0R  [R0201]
R2726  0R  [R0201]
R2727  10K  [R0201]
R2728  1M  [R0402]
R2729  10K  [R0201]
R2730  2.2K  [R0402]
R2731  0R  [R0201]
R2732  2.2K  [R0402]
R2733  41.2K  [R0402]
R2996  0R  ASSY_OPT: DNP  [R0201]
R2997  0R  ASSY_OPT: DNP  [R0201]
U719  IT6263  [qfn64_0p5_9x9_157ep]
U720  TPD4E05U06DQAR  [USON-10]
U721  TPD4E05U06DQAR  [USON-10]
U722  MBR0540  [SOD_123]
Y404  27MHZ  [xtlosc4_3p2x2p5mm_sm]

### Nets
ANVDD_1V8: C903.1 C904.1 C905.1 C906.1 C907.1 FB30.2 U719.17(ANVDD1) U719.27(ANVDD2) U719.36(ANVDD3) U719.44(ANVDD4)
APVDD_1V8: C896.1 C897.1 FB27.2 U719.32(APVDD)
AVCC_3V3: C898.1 C899.1 C900.1 FB28.2 U719.22(AVCC1) U719.41(AVCC2)
GND: C885.2 C886.2 C887.2 C888.2 C889.2 C890.2 C891.2 C892.2 C893.2 C894.2 C895.2 C896.2 C897.2 C898.2 C899.2 C900.2 C901.2 C902.2 C903.2 C904.2 C905.2 C906.2 C907.2 C908.2 C909.2 C910.2 C911.2 C912.2 C913.2 C914.1 C915.1 C916.2 D609.2 D610.2 D611.2 D612.2 P5.2(D2_G) P5.5(D1_G) P5.8(D0_G) P5.11(CLK_G) P5.17(GND) P5.20(G1) P5.21(G2) P5.22(G3) P5.23(G4) R2724.2 R2727.2 R2733.1 U719.65(EP_PAD) U720.3(GND1) U720.8(GND2) U721.3(GND1) U721.8(GND2) Y404.2 Y404.4
HDMI_5V: C913.1 D609.1 F5.2 P5.18(+5V) R2730.1 R2732.1
IVDD_1V8: C891.1 C892.1 C893.1 C894.1 C895.1 FB26.2 U719.10(IVDD1) U719.35(IVDD2) U719.49(IVDD3) U719.64(IVDD4)
OVDD_3V3: C887.1 C888.1 FB24.2 U719.11(OVDD)
PVCC1_1V8: C889.1 C890.1 FB25.2 U719.51(PVCC1)
PVCC2_1V8: C901.1 C902.1 FB29.2 U719.62(PVCC2)
TXAVCC_1V8: C908.1 C909.1 C910.1 FB31.2 R2720.2 U719.54(TXAVCC18_1) U719.59(TXAVCC18_2)
TXAVCC_3V3: C885.1 C886.1 FB23.2 U719.63(TXAVCC33)
VDD_1V8: FB25.1 FB26.1 FB27.1 FB29.1 FB30.1 FB31.1  [project net LPD4/x_VDD1]
VDD_3V3: FB23.1 FB24.1 FB28.1 R2729.2
VDD_5V: C911.1 C912.1 U722.1(A)
A2_LVDS_D2_N: U719.23(RXNC1) ; off-sheet A2_LVDS_D2_N  [project net LVDS_TX2_N]
A3_LVDS_CLK_N: U719.25(RXNCLK) ; off-sheet A3_LVDS_CLK_N  [project net LVDS_CLK_N]
A4_LVDS_D1_N: U719.20(RXNB1) ; off-sheet A4_LVDS_D1_N  [project net LVDS_TX1_N]
A5_LVDS_D0_N: U719.18(RXNA1) ; off-sheet A5_LVDS_D0_N  [project net LVDS_TX0_N]
B1_LVDS_D3_N: U719.28(RXND1) ; off-sheet B1_LVDS_D3_N  [project net LVDS_TX3_N]
B2_LVDS_D2_P: U719.24(RXPC1) ; off-sheet B2_LVDS_D2_P  [project net LVDS_TX2_P]
B3_LVDS_CLK_P: U719.26(RXPCLK) ; off-sheet B3_LVDS_CLK_P  [project net LVDS_CLK_P]
B4_LVDS_D1_P: U719.21(RXPB1) ; off-sheet B4_LVDS_D1_P  [project net LVDS_TX1_P]
B5_LVDS_D0_P: U719.19(RXPA1) ; off-sheet B5_LVDS_D0_P  [project net LVDS_TX0_P]
C1_LVDS_D3_P: U719.29(RXPD1) ; off-sheet C1_LVDS_D3_P  [project net LVDS_TX3_P]
DDC_SCL: D610.1 P5.15(SCL) R2721.2 R2730.2
DDC_SDA: D611.1 P5.16(SDA) R2722.2 R2732.2
DDCSCL: R2721.1 U719.4(DDCSCL)
DDCSDA: R2722.1 U719.5(DDCSDA)
HDMI_CLK_N: P5.12(CLKN) U719.52(TXCM) U721.5(D2-) U721.6(NC4)
HDMI_CLK_P: P5.10(CLKP) U719.53(TXCP) U721.4(D2+) U721.7(NC3)
HDMI_D0_N: P5.9(D0N) U719.55(TX0M) U721.2(D1-) U721.9(NC2)
HDMI_D0_P: P5.7(D0P) U719.56(TX0P) U721.1(D1+) U721.10(NC1)
HDMI_D1_N: P5.6(D1N) U719.57(TX1M) U720.5(D2-) U720.6(NC4)
HDMI_D1_P: P5.4(D1P) U719.58(TX1P) U720.4(D2+) U720.7(NC3)
HDMI_D2_N: P5.3(D2N) U719.60(TX2M) U720.2(D1-) U720.9(NC2)
HDMI_D2_P: P5.1(D2P) U719.61(TX2P) U720.1(D1+) U720.10(NC1)
HDMI_HPD: D612.1 P5.19(HPD) R2733.2 U719.3(TXHPD)
HDMI_XTALIN: C914.2 R2728.2 U719.33(XTALIN) Y404.1
HDMI_XTALOUT: C915.2 R2728.1 U719.34(XTALOUT) Y404.3
I2C1_SCL: R2725.2 ; off-sheet I2C1_SCL
I2C1_SDA: R2726.2 ; off-sheet I2C1_SDA
I2C4_SCL: R2996.2 ; off-sheet I2C4_SCL
I2C4_SDA: R2997.2 ; off-sheet I2C4_SDA
LVDS_nRST: R2731.2 ; off-sheet LVDS_nRST
LVDS_RST: C916.1 R2729.1 R2731.1 U719.2(SYSRSTN)
PCADR: R2724.1 U719.14(PCADR)
TXEMEM_VPP: R2727.1 U719.1(TXEMEM_VPP)
TXREXT: R2720.1 U719.50(TXREXT)
NetF5_1: F5.1 U722.2(C)
NetR2725_1: R2725.1 R2996.1 U719.15(PCSCL)
NetR2726_1: R2726.1 R2997.1 U719.16(PCSDA)

Not connected (* = marked no-connect by the designer): P5 13(CEC)* 14(Utility)*; U719 6(I2S3)* 7(I2S2)* 8(I2S1)* 9(I2S0)* 12(WS_SPDIF)* 13(SCL_MCLK)* 30(RXNE1)* 31(RXPE1)* 37(RXNA2)* 38(RXPA2)* 39(RXNB2)* 40(RXPB2)* 42(RXNC2)* 43(RXPC2)* 45(RXND2)* 46(RXPD2)* 47(RXNE2)* 48(RXPE2)*

### Layout directives
differential pair: HDMI_CLK_N, HDMI_CLK_P, HDMI_D0_N, HDMI_D0_P, HDMI_D1_N, HDMI_D1_P, HDMI_D2_N, HDMI_D2_P

### Notes on the sheet
- (near U719) #I2C ADDR: 0x98
- DWG. NO.
- REV.
- SHT.
- REVISION
- DESCRIPTION
- DATE
- APPROVED
- ENG:
- APPROVALS
- quilter.ai <http://quilter.ai>
- DSN:
- CHK:
- REFERENCE DOCUMENTS
- TITLE
- PROJECT
- BOM:
- FAB DWG:
- PCB DWG:
- ASSY DWG:
- SIZE
- FILE NAME
- C
- DWG NO.
- SHEET
- OF
- REV
- (in symbol HDMI_A) Type A
- (in symbol IT6263) 3V3; 1V8
- (in symbol TitleBlock_MCPG) Microcontroller Product Group; 6501 William Cannon Drive West / Austin, TX 78735-8598; This document contains information proprietary to NXP and shall not be used for engineering design,; procurement or manufacture in whole or in part without the express written permission of NXP Semiconductors.; ©; NXP SEMICONDUCTORS; Classification:; Designer:; Drawing Title:; Drawn by:; Page Title:; Approved:; Size; Document Number; Rev; Date:; Sheet; of

### Library data of the parts
*#16 = TitleBlock_MCPG: Classification: Public, Company Internal/Proprietary, Company Confidential,  Company Secret; OrgAddr1: NO. 192 Liangjing Rd. Pudong New Area, ShangHai; OrgName: NXP Semiconductor; Page Size: =PageSize; Page Create Date: March  8, 1995; Designer: FORLINX; Page Modify Date: =ModifiedDate
C885 = CAP NP: 0402,10uF,6.3V,+/-20%,X5R; Part Reference: C885; Manufacturer PN: 0402X104K6R3NT; Manufacturer: FH(·ç»ª); MFG_NAME01: FENGHUA; Tolerance: ¡À10%; Priority: A; RK PN: 902004347; MFG_PN01: 0402X106M6R3NT; PCB Footprint: C0402; Value: 10uF; Created by: JJJ; Part Type: Ò»°ãÓÃÆ¬×´ÌÕ´ÉµçÈÝ
C886 = CAP NP: 0201,100nF,25V,+/-10%,X5R; Part Reference: C886; Manufacturer: FH(·ç»ª); Manufacturer PN: 0402X104K6R3NT; MFG_NAME01: FENGHUA; RK PN: 902004347; Priority: A; Tolerance: ¡À10%; MFG_PN01: 0201X104K250NT; PCB Footprint: C0201; Value: 100nF; Part Type: Ò»°ãÓÃÆ¬×´ÌÕ´ÉµçÈÝ; Created by: JJJ
C887 = CAP NP: 0402,10uF,6.3V,+/-20%,X5R; Part Reference: C887; Manufacturer PN: 0402X104K6R3NT; Manufacturer: FH(·ç»ª); MFG_NAME01: FENGHUA; Tolerance: ¡À10%; Priority: A; RK PN: 902004347; MFG_PN01: 0402X106M6R3NT; PCB Footprint: C0402; Value: 10uF; Created by: JJJ; Part Type: Ò»°ãÓÃÆ¬×´ÌÕ´ÉµçÈÝ
C888 = CAP NP: 0201,100nF,25V,+/-10%,X5R; Part Reference: C888; Manufacturer: FH(·ç»ª); Manufacturer PN: 0402X104K6R3NT; MFG_NAME01: FENGHUA; RK PN: 902004347; Priority: A; Tolerance: ¡À10%; MFG_PN01: 0201X104K250NT; PCB Footprint: C0201; Value: 100nF; Part Type: Ò»°ãÓÃÆ¬×´ÌÕ´ÉµçÈÝ; Created by: JJJ
C889 = CAP NP: 0402,10uF,6.3V,+/-20%,X5R; Part Reference: C889; Manufacturer PN: 0402X104K6R3NT; Manufacturer: FH(·ç»ª); MFG_NAME01: FENGHUA; Tolerance: ¡À10%; Priority: A; RK PN: 902004347; MFG_PN01: 0402X106M6R3NT; PCB Footprint: C0402; Value: 10uF; Created by: JJJ; Part Type: Ò»°ãÓÃÆ¬×´ÌÕ´ÉµçÈÝ
C890 = CAP NP: 0201,100nF,25V,+/-10%,X5R; Part Reference: C890; Manufacturer: FH(·ç»ª); Manufacturer PN: 0402X104K6R3NT; MFG_NAME01: FENGHUA; RK PN: 902004347; Priority: A; Tolerance: ¡À10%; MFG_PN01: 0201X104K250NT; PCB Footprint: C0201; Value: 100nF; Part Type: Ò»°ãÓÃÆ¬×´ÌÕ´ÉµçÈÝ; Created by: JJJ
C891 = CAP NP: 0402,10uF,6.3V,+/-20%,X5R; Part Reference: C891; Manufacturer PN: 0402X104K6R3NT; Manufacturer: FH(·ç»ª); MFG_NAME01: FENGHUA; Tolerance: ¡À10%; Priority: A; RK PN: 902004347; MFG_PN01: 0402X106M6R3NT; PCB Footprint: C0402; Value: 10uF; Created by: JJJ; Part Type: Ò»°ãÓÃÆ¬×´ÌÕ´ÉµçÈÝ
C892 = CAP NP: 0201,100nF,25V,+/-10%,X5R; Part Reference: C892; Manufacturer: FH(·ç»ª); Manufacturer PN: 0402X104K6R3NT; MFG_NAME01: FENGHUA; RK PN: 902004347; Priority: A; Tolerance: ¡À10%; MFG_PN01: 0201X104K250NT; PCB Footprint: C0201; Value: 100nF; Part Type: Ò»°ãÓÃÆ¬×´ÌÕ´ÉµçÈÝ; Created by: JJJ
C893 = CAP NP: 0201,100nF,25V,+/-10%,X5R; Part Reference: C893; Manufacturer PN: 0402X104K6R3NT; Manufacturer: FH(·ç»ª); MFG_NAME01: FENGHUA; Tolerance: ¡À10%; Priority: A; RK PN: 902004347; MFG_PN01: 0201X104K250NT; PCB Footprint: C0201; Value: 100nF; Created by: JJJ; Part Type: Ò»°ãÓÃÆ¬×´ÌÕ´ÉµçÈÝ
C894 = CAP NP: 0201,100nF,25V,+/-10%,X5R; Part Reference: C894; Manufacturer PN: 0402X104K6R3NT; Manufacturer: FH(·ç»ª); MFG_NAME01: FENGHUA; Tolerance: ¡À10%; Priority: A; RK PN: 902004347; MFG_PN01: 0201X104K250NT; PCB Footprint: C0201; Value: 100nF; Created by: JJJ; Part Type: Ò»°ãÓÃÆ¬×´ÌÕ´ÉµçÈÝ
C895 = CAP NP: 0201,100nF,25V,+/-10%,X5R; Part Reference: C895; Manufacturer: FH(·ç»ª); Manufacturer PN: 0402X104K6R3NT; MFG_NAME01: FENGHUA; RK PN: 902004347; Priority: A; Tolerance: ¡À10%; MFG_PN01: 0201X104K250NT; PCB Footprint: C0201; Value: 100nF; Part Type: Ò»°ãÓÃÆ¬×´ÌÕ´ÉµçÈÝ; Created by: JJJ
C896 = CAP NP: 0402,10uF,6.3V,+/-20%,X5R; Part Reference: C896; Manufacturer PN: 0402X104K6R3NT; Manufacturer: FH(·ç»ª); MFG_NAME01: FENGHUA; Tolerance: ¡À10%; Priority: A; RK PN: 902004347; MFG_PN01: 0402X106M6R3NT; PCB Footprint: C0402; Value: 10uF; Created by: JJJ; Part Type: Ò»°ãÓÃÆ¬×´ÌÕ´ÉµçÈÝ
C897 = CAP NP: 0201,100nF,25V,+/-10%,X5R; Part Reference: C897; Manufacturer PN: 0402X104K6R3NT; Manufacturer: FH(·ç»ª); MFG_NAME01: FENGHUA; Tolerance: ¡À10%; Priority: A; RK PN: 902004347; MFG_PN01: 0201X104K250NT; PCB Footprint: C0201; Value: 100nF; Created by: JJJ; Part Type: Ò»°ãÓÃÆ¬×´ÌÕ´ÉµçÈÝ
C898 = CAP NP: 0402,10uF,6.3V,+/-20%,X5R; Part Reference: C898; Manufacturer: FH(·ç»ª); Manufacturer PN: 0402X104K6R3NT; MFG_NAME01: FENGHUA; RK PN: 902004347; Priority: A; Tolerance: ¡À10%; MFG_PN01: 0402X106M6R3NT; PCB Footprint: C0402; Value: 10uF; Part Type: Ò»°ãÓÃÆ¬×´ÌÕ´ÉµçÈÝ; Created by: JJJ
C899 = CAP NP: 0201,100nF,25V,+/-10%,X5R; Part Reference: C899; Manufacturer PN: 0402X104K6R3NT; Manufacturer: FH(·ç»ª); MFG_NAME01: FENGHUA; Tolerance: ¡À10%; Priority: A; RK PN: 902004347; MFG_PN01: 0201X104K250NT; PCB Footprint: C0201; Value: 100nF; Created by: JJJ; Part Type: Ò»°ãÓÃÆ¬×´ÌÕ´ÉµçÈÝ
C900 = CAP NP: 0201,100nF,25V,+/-10%,X5R; Part Reference: C900; Manufacturer PN: 0402X104K6R3NT; Manufacturer: FH(·ç»ª); MFG_NAME01: FENGHUA; Tolerance: ¡À10%; Priority: A; RK PN: 902004347; MFG_PN01: 0201X104K250NT; PCB Footprint: C0201; Value: 100nF; Created by: JJJ; Part Type: Ò»°ãÓÃÆ¬×´ÌÕ´ÉµçÈÝ
C901 = CAP NP: 0402,10uF,6.3V,+/-20%,X5R; Part Reference: C901; Manufacturer: FH(·ç»ª); Manufacturer PN: 0402X104K6R3NT; MFG_NAME01: FENGHUA; RK PN: 902004347; Priority: A; Tolerance: ¡À10%; MFG_PN01: 0402X106M6R3NT; PCB Footprint: C0402; Value: 10uF; Part Type: Ò»°ãÓÃÆ¬×´ÌÕ´ÉµçÈÝ; Created by: JJJ
C902 = CAP NP: 0201,100nF,25V,+/-10%,X5R; Part Reference: C902; Manufacturer PN: 0402X104K6R3NT; Manufacturer: FH(·ç»ª); MFG_NAME01: FENGHUA; Tolerance: ¡À10%; Priority: A; RK PN: 902004347; MFG_PN01: 0201X104K250NT; PCB Footprint: C0201; Value: 100nF; Created by: JJJ; Part Type: Ò»°ãÓÃÆ¬×´ÌÕ´ÉµçÈÝ
C903 = CAP NP: 0402,10uF,6.3V,+/-20%,X5R; Part Reference: C903; Manufacturer PN: 0402X104K6R3NT; Manufacturer: FH(·ç»ª); MFG_NAME01: FENGHUA; Tolerance: ¡À10%; Priority: A; RK PN: 902004347; MFG_PN01: 0402X106M6R3NT; PCB Footprint: C0402; Value: 10uF; Created by: JJJ; Part Type: Ò»°ãÓÃÆ¬×´ÌÕ´ÉµçÈÝ
C904 = CAP NP: 0201,100nF,25V,+/-10%,X5R; Part Reference: C904; Manufacturer: FH(·ç»ª); Manufacturer PN: 0402X104K6R3NT; MFG_NAME01: FENGHUA; RK PN: 902004347; Priority: A; Tolerance: ¡À10%; MFG_PN01: 0201X104K250NT; PCB Footprint: C0201; Value: 100nF; Part Type: Ò»°ãÓÃÆ¬×´ÌÕ´ÉµçÈÝ; Created by: JJJ
C905 = CAP NP: 0201,100nF,25V,+/-10%,X5R; Part Reference: C905; Manufacturer PN: 0402X104K6R3NT; Manufacturer: FH(·ç»ª); MFG_NAME01: FENGHUA; Tolerance: ¡À10%; Priority: A; RK PN: 902004347; MFG_PN01: 0201X104K250NT; PCB Footprint: C0201; Value: 100nF; Created by: JJJ; Part Type: Ò»°ãÓÃÆ¬×´ÌÕ´ÉµçÈÝ
C906 = CAP NP: 0201,100nF,25V,+/-10%,X5R; Part Reference: C906; Manufacturer PN: 0402X104K6R3NT; Manufacturer: FH(·ç»ª); MFG_NAME01: FENGHUA; Tolerance: ¡À10%; Priority: A; RK PN: 902004347; MFG_PN01: 0201X104K250NT; PCB Footprint: C0201; Value: 100nF; Created by: JJJ; Part Type: Ò»°ãÓÃÆ¬×´ÌÕ´ÉµçÈÝ
C907 = CAP NP: 0201,100nF,25V,+/-10%,X5R; Part Reference: C907; Manufacturer: FH(·ç»ª); Manufacturer PN: 0402X104K6R3NT; MFG_NAME01: FENGHUA; RK PN: 902004347; Priority: A; Tolerance: ¡À10%; MFG_PN01: 0201X104K250NT; PCB Footprint: C0201; Value: 100nF; Part Type: Ò»°ãÓÃÆ¬×´ÌÕ´ÉµçÈÝ; Created by: JJJ
C908 = CAP NP: 0402,10uF,6.3V,+/-20%,X5R; Part Reference: C908; Manufacturer PN: 0402X104K6R3NT; Manufacturer: FH(·ç»ª); MFG_NAME01: FENGHUA; Tolerance: ¡À10%; Priority: A; RK PN: 902004347; MFG_PN01: 0402X106M6R3NT; PCB Footprint: C0402; Value: 10uF; Created by: JJJ; Part Type: Ò»°ãÓÃÆ¬×´ÌÕ´ÉµçÈÝ
C909 = CAP NP: 0201,100nF,25V,+/-10%,X5R; Part Reference: C909; Manufacturer: FH(·ç»ª); Manufacturer PN: 0402X104K6R3NT; MFG_NAME01: FENGHUA; RK PN: 902004347; Priority: A; Tolerance: ¡À10%; MFG_PN01: 0201X104K250NT; PCB Footprint: C0201; Value: 100nF; Part Type: Ò»°ãÓÃÆ¬×´ÌÕ´ÉµçÈÝ; Created by: JJJ
C910 = CAP NP: 0201,100nF,25V,+/-10%,X5R; Part Reference: C910; Manufacturer: FH(·ç»ª); Manufacturer PN: 0402X104K6R3NT; MFG_NAME01: FENGHUA; RK PN: 902004347; Priority: A; Tolerance: ¡À10%; MFG_PN01: 0201X104K250NT; PCB Footprint: C0201; Value: 100nF; Part Type: Ò»°ãÓÃÆ¬×´ÌÕ´ÉµçÈÝ; Created by: JJJ
C911 = CAP NP: 0201,100nF,25V,+/-10%,X5R; Part Reference: C911; Manufacturer PN: 0402X104K6R3NT; Manufacturer: FH(·ç»ª); MFG_NAME01: FENGHUA; Tolerance: ¡À10%; Priority: A; RK PN: 902004347; MFG_PN01: 0201X104K250NT; PCB Footprint: C0201; Value: 100nF; Created by: JJJ; Part Type: Ò»°ãÓÃÆ¬×´ÌÕ´ÉµçÈÝ
C912 = CAP NP: 0402,10uF,6.3V,+/-20%,X5R; Part Reference: C912; Manufacturer PN: 0402X104K6R3NT; Manufacturer: FH(·ç»ª); MFG_NAME01: FENGHUA; Tolerance: ¡À10%; Priority: A; RK PN: 902004347; MFG_PN01: 0402X106M6R3NT; PCB Footprint: C0402; Value: 10uF; Created by: JJJ; Part Type: Ò»°ãÓÃÆ¬×´ÌÕ´ÉµçÈÝ
C913 = CAP NP: 0402,1uF,16V,+/-10%,X5R; Part Reference: C913; Manufacturer: FH(·ç»ª); Manufacturer PN: 0402X104K6R3NT; MFG_NAME01: SAMSUNG; RK PN: 902004347; Priority: A; Tolerance: ¡À10%; MFG_PN01: CL05A105KO5NNNC; PCB Footprint: C0402; Value: 1uF; Part Type: Ò»°ãÓÃÆ¬×´ÌÕ´ÉµçÈÝ; Created by: JJJ
C914 = CAP NP: 0402,15pF,50V,+/-5%,NPO; Part Reference: C914; Manufacturer: FH(·ç»ª); Manufacturer PN: 0402X104K6R3NT; Dielectric: X5R; MFG_NAME01: FENGHUA; RK PN: 902004347; Priority: A; Tolerance: ¡À10%; MFG_PN01: 0402B102K500NT; PCB Footprint: C0402; Value: 15pF; Part Type: Ò»°ãÓÃÆ¬×´ÌÕ´ÉµçÈÝ; Created by: JJJ
C915 = CAP NP: 0402,15pF,50V,+/-5%,NPO; Part Reference: C915; Manufacturer: FH(·ç»ª); Manufacturer PN: 0402X104K6R3NT; Dielectric: X5R; MFG_NAME01: FENGHUA; RK PN: 902004347; Priority: A; Tolerance: ¡À10%; MFG_PN01: 0402B102K500NT; PCB Footprint: C0402; Value: 15pF; Part Type: Ò»°ãÓÃÆ¬×´ÌÕ´ÉµçÈÝ; Created by: JJJ
C916 = CAP NP: 0201,1uF,10V,+/-20%,X5R; Part Reference: C916; Manufacturer PN: 0402X104K6R3NT; Manufacturer: FH(·ç»ª); MFG_NAME01: SAMSUNG; Tolerance: ¡À10%; Priority: A; RK PN: 902004347; MFG_PN01: CL03A105MP3NSNC; PCB Footprint: C0201; Value: 1uF; Created by: JJJ; Part Type: Ò»°ãÓÃÆ¬×´ÌÕ´ÉµçÈÝ
D609 = ESD5451N-2/TR: Part Reference: D609; MFG_NAME01: WILLSEMI; Value: ESD5451N-2/TR; MFG_PN01: ESD5451N-2/TR; PCB Footprint: 0402TVS
D610 = ESD5341N: ESD5341N-2/TR; Part Reference: D610; MFG_NAME01: WILLSEMI; Value: ESD5341N; MFG_PN01: ESD5341N-2/TR; PCB Footprint: 0402TVS
D611 = ESD5341N: ESD5341N-2/TR; Part Reference: D611; MFG_NAME01: WILLSEMI; Value: ESD5341N; MFG_PN01: ESD5341N-2/TR; PCB Footprint: 0402TVS
D612 = ESD5341N: ESD5341N-2/TR; Part Reference: D612; MFG_NAME01: WILLSEMI; Value: ESD5341N; MFG_PN01: ESD5341N-2/TR; PCB Footprint: 0402TVS
F5 = FUSE_0.5A: 0603,0.04A/0.12A,15V,ASMD0603-004; Part Reference: F5; MFG_NAME01: SAMSUNG; MFG_PN01: CL05A225KP5NSNC; Value: FUSE_0.04A; PCB Footprint: F0603
FB23 = FB0402,120ohm,1.3A: 0603,120Ohm@100MHZ,3A; Part Reference: FB23; serial number: 1110304038; MFG_PN01: UPZ1608E121-3R0TF; MFG_NAME01: Sunlord; PCB Footprint: FB0603; Value: 120 Ohm
FB24 = FB0402,120ohm,1.3A: 0603,120Ohm@100MHZ,3A; Part Reference: FB24; serial number: 1110304038; MFG_PN01: UPZ1608E121-3R0TF; MFG_NAME01: Sunlord; PCB Footprint: FB0603; Value: 120 Ohm
FB25 = FB0402,120ohm,1.3A: 0603,120Ohm@100MHZ,3A; Part Reference: FB25; serial number: 1110304038; MFG_PN01: UPZ1608E121-3R0TF; MFG_NAME01: Sunlord; PCB Footprint: FB0603; Value: 120 Ohm
FB26 = FB0402,120ohm,1.3A: 0603,120Ohm@100MHZ,3A; Part Reference: FB26; serial number: 1110304038; MFG_PN01: UPZ1608E121-3R0TF; MFG_NAME01: Sunlord; PCB Footprint: FB0603; Value: 120 Ohm
FB27 = FB0402,120ohm,1.3A: 0603,120Ohm@100MHZ,3A; Part Reference: FB27; serial number: 1110304038; MFG_PN01: UPZ1608E121-3R0TF; MFG_NAME01: Sunlord; PCB Footprint: FB0603; Value: 120 Ohm
FB28 = FB0402,120ohm,1.3A: 0603,120Ohm@100MHZ,3A; Part Reference: FB28; serial number: 1110304038; MFG_PN01: UPZ1608E121-3R0TF; MFG_NAME01: Sunlord; PCB Footprint: FB0603; Value: 120 Ohm
FB29 = FB0402,120ohm,1.3A: 0603,120Ohm@100MHZ,3A; Part Reference: FB29; serial number: 1110304038; MFG_NAME01: Sunlord; MFG_PN01: UPZ1608E121-3R0TF; PCB Footprint: FB0603; Value: 120 Ohm
FB30 = FB0402,120ohm,1.3A: 0603,120Ohm@100MHZ,3A; Part Reference: FB30; serial number: 1110304038; MFG_NAME01: Sunlord; MFG_PN01: UPZ1608E121-3R0TF; PCB Footprint: FB0603; Value: 120 Ohm
FB31 = FB0402,120ohm,1.3A: 0603,120Ohm@100MHZ,3A; Part Reference: FB31; serial number: 1110304038; MFG_PN01: UPZ1608E121-3R0TF; MFG_NAME01: Sunlord; PCB Footprint: FB0603; Value: 120 Ohm
P5 = HDMI_A: HDMI-A; Part Reference: P5; Manufacturer: Íú¿Æ´ï; Manufacturer Part Number: HDMI_01A; MFG_NAME01: ANUOCONN; RK PN: 908,000,005; Priority: A; Value: HDMI_A; Part Type: HDMI Jack; Created by: JJJ; MFG_PN01: HDMI-A; PCB Footprint: HDMIA19_HDMI_01A
R2720 = R0402,4.7K_Dup1: 0402,698Ohm,+/-1%; Part Reference: R2720; precision: ¡À1£¥; serial number: 1110102015; MFG_NAME01: FENGHUA; MFG_PN01: RC-02K6980FT; PCB Footprint: R0402; Value: 698R
R2721 = R0402,4.7K_Dup1: 0402,33Ohm,+/-1%; Part Reference: R2721; precision: ¡À1£¥; serial number: 1110102015; MFG_NAME01: FENGHUA; MFG_PN01: RC-02K33R0FT; PCB Footprint: R0402; Value: 33R
R2722 = R0402,4.7K_Dup1: 0402,33Ohm,+/-1%; Part Reference: R2722; precision: ¡À1£¥; serial number: 1110102015; MFG_NAME01: FENGHUA; MFG_PN01: RC-02K33R0FT; PCB Footprint: R0402; Value: 33R
R2724 = R0402,4.7K_Dup1: 0201,10K,+/-5%; Part Reference: R2724; precision: ¡À1£¥; serial number: 1110102015; MFG_NAME01: FENGHUA; MFG_PN01: RC-01W103JT; PCB Footprint: R0201; Value: 10K
R2725 = R0402,4.7K_Dup1: 0201,0Ohm,+/-5%; Part Reference: R2725; precision: ¡À1£¥; serial number: 1110102015; MFG_NAME01: FENGHUA; MFG_PN01: RC-01000JT; PCB Footprint: R0201; Value: 0R
R2726 = R0402,4.7K_Dup1: 0201,0Ohm,+/-5%; Part Reference: R2726; precision: ¡À1£¥; serial number: 1110102015; MFG_NAME01: FENGHUA; MFG_PN01: RC-01000JT; PCB Footprint: R0201; Value: 0R
R2727 = R0402,4.7K_Dup1: 0201,10K,+/-5%; Part Reference: R2727; precision: ¡À1£¥; serial number: 1110102015; MFG_NAME01: FENGHUA; MFG_PN01: RC-01W103JT; PCB Footprint: R0201; Value: 10K
R2728 = R0402,4.7K_Dup1: 0402,1M,+/-1%; Part Reference: R2728; precision: ¡À1£¥; serial number: 1110102015; MFG_NAME01: FENGHUA; MFG_PN01: RC-02K1004FT; PCB Footprint: R0402; Value: 1M
R2729 = R0402,4.7K_Dup1: 0201,10K,+/-5%; Part Reference: R2729; precision: ¡À1£¥; serial number: 1110102015; MFG_NAME01: FENGHUA; MFG_PN01: RC-01W103JT; PCB Footprint: R0201; Value: 10K
R2730 = R0402,4.7K_Dup1: 0402,2.2K,+/-1%; Part Reference: R2730; precision: ¡À1£¥; serial number: 1110102015; MFG_NAME01: FENGHUA; MFG_PN01: RC-02K2201FT; PCB Footprint: R0402; Value: 2.2K
R2731 = R0402,4.7K_Dup1: 0201,0Ohm,+/-5%; Part Reference: R2731; precision: ¡À1£¥; serial number: 1110102015; MFG_NAME01: FENGHUA; MFG_PN01: RC-01000JT; PCB Footprint: R0201; Value: 0R
R2732 = R0402,4.7K_Dup1: 0402,2.2K,+/-1%; Part Reference: R2732; precision: ¡À1£¥; serial number: 1110102015; MFG_NAME01: FENGHUA; MFG_PN01: RC-02K2201FT; PCB Footprint: R0402; Value: 2.2K
R2733 = R0402,4.7K_Dup1: 0402,41.2K,+/-1%; Part Reference: R2733; precision: ¡À1£¥; serial number: 1110102015; MFG_NAME01: FENGHUA; MFG_PN01: RC-02W4122FT; PCB Footprint: R0402; Value: 41.2K
R2996 = R0402,4.7K_Dup1: 0201,0Ohm,+/-5%; Part Reference: R2996; precision: ¡À1£¥; serial number: 1110102015; MFG_NAME01: FENGHUA; MFG_PN01: RC-01000JT; PCB Footprint: R0201; Value: 0R
R2997 = R0402,4.7K_Dup1: 0201,0Ohm,+/-5%; Part Reference: R2997; precision: ¡À1£¥; serial number: 1110102015; MFG_NAME01: FENGHUA; MFG_PN01: RC-01000JT; PCB Footprint: R0201; Value: 0R
U719 = IT6263: IT6263FN,QFN64,9*9mm,LVDS to HDMI; Part Reference: U719; MFG_NAME01: ITE; Value: IT6263; MFG_PN01: IT6263FN; PCB Footprint: qfn64_0p5_9x9_157ep
U720 = TPD4E05U06DQAR_10: TPD4E05U06DQAR,USON; Part Reference: U720; MFG_NAME01: TI; Value: TPD4E05U06DQAR; MFG_PN01: TPD4E05U06DQAR; PCB Footprint: USON-10
U721 = TPD4E05U06DQAR_5: TPD4E05U06DQAR,USON; Part Reference: U721; MFG_NAME01: TI; Value: TPD4E05U06DQAR; MFG_PN01: TPD4E05U06DQAR; PCB Footprint: USON-10
U722 = MBR0540_0: MBR0540,SOD123; Part Reference: U722; MFG_NAME01: Cystek; Value: MBR0540; MFG_PN01: MBR0540; PCB Footprint: SOD_123
Y404 = XTAL_13: Crystal,27MHZ,4P,3.2*2.5mm,+/-20ppm,20pf; Part Reference: Y404; CLASS: IC; MFG_NAME01: SCTF; MFG_PN01: SX5B27.000F2020F30; CAD_APPROVED: Yes; Value: 27MHZ; ROHS: Yes; HEIGHT: 0.60MM; PCB Footprint: xtlosc4_3p2x2p5mm_sm